# Altium project Extra_Board_Mini.PrjPcb
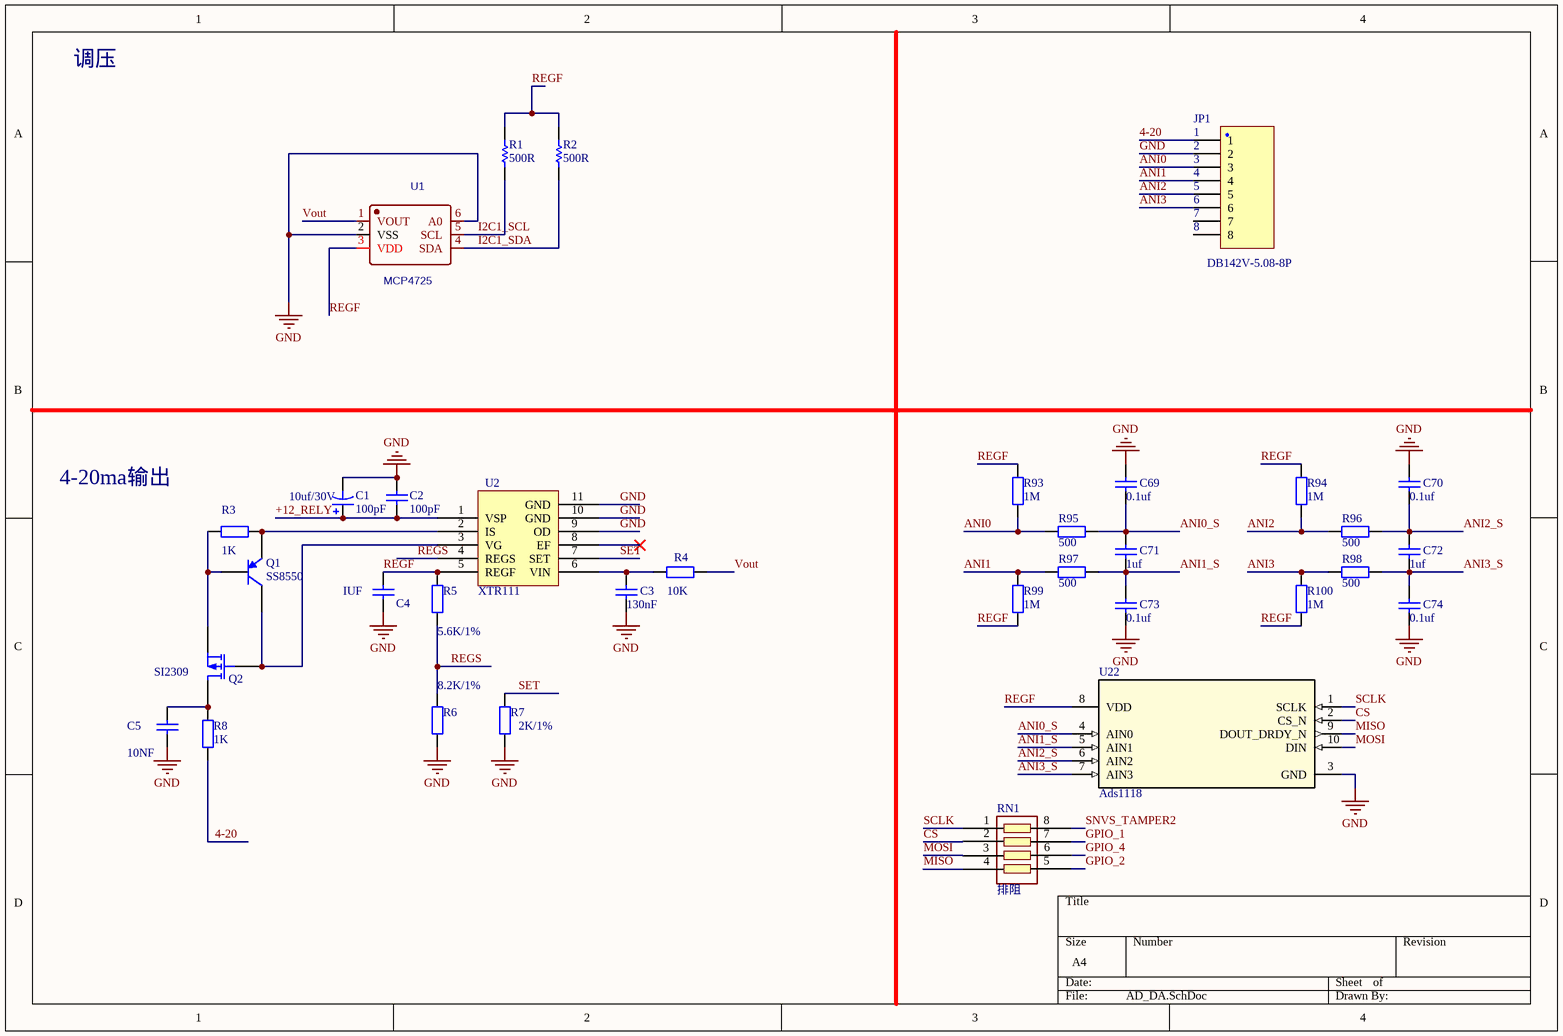
[diagram p0: AD_DA.SchDoc]
6 sheets, 249 parts. Net scope: global (net labels, ports and power ports of the same name join across sheets).
Board file: LinuxMini_ExtraBoard.PcbDoc
Sheets:
  AD_DA.SchDoc
  AD7799.SchDoc
  Connect.SchDoc
  Power.SchDoc
  DIn.SchDoc
  DOut.SchDoc

## Sheet AD_DA.SchDoc
size A4; SheetNumber: 1; SheetTotal: 6

### Parts
C1  10uf/30V  value 100pF  [CC5.05.4]
C2  value 100pF  [0603c]  (hidden comment: 104)
C3  130nF  [0603]
C4  IUF  [0603c]
C5  10NF  [0603c]
C69  0.1uf  [0603c]
C70  0.1uf  [0603c]
C71  1uf  [0603c]
C72  1uf  [0603c]
C73  0.1uf  [0603c]
C74  0.1uf  [0603c]
JP1  DB142V-5.08-8P  [DB142V-5.08-8P]
Q1  SS8550  [SOT-23]
Q2  SI2309  [SOT-23]
R1  500R  [0603r]
R2  500R  [0603r]
R3  value 1K  [0603_R]  (hidden comment: 15R)
R4  10K  [0603_R]
R5  5.6K/1%  [0603_R]
R6  8.2K/1%  [0603_R]
R7  2K/1%  [0603_R]
R8  value 1K  [0603_R]  (hidden comment: 15R)
R93  1M  [0603r]
R94  1M  [0603r]
R95  500  [0603r]
R96  500  [0603r]
R97  500  [0603r]
R98  500  [0603r]
R99  1M  [0603r]
R100  1M  [0603r]
RN1  排阻  [RES_Network]
U1  MCP4725  [MCP4725]
U2  XTR111  [XTR111]
U22  Ads1118  [ads1118]

### Nets
+12_RELY: C1.1 C2.2 U2.1(VSP)
GND: C1.2 C2.1 C3.2 C4.1 C5.2 C69.1 C70.1 C73.2 C74.2 JP1.2 R6.2 R7.1 U1.2(VSS) U1.6(A0) U2.9(OD) U2.10(GND) U2.11(GND) U22.3(GND)
4-20: JP1.1 R8.2
ANI0: JP1.3 R93.1 R95.2
ANI0_S: C69.2 C71.1 R95.1 U22.4(AIN0)
ANI1: JP1.4 R97.1 R99.1
ANI1_S: C71.2 C73.1 R97.2 U22.5(AIN1)
ANI2: JP1.5 R94.1 R96.2
ANI2_S: C70.2 C72.1 R96.1 U22.6(AIN2)
ANI3: JP1.6 R98.1 R100.1
ANI3_S: C72.2 C74.1 R98.2 U22.7(AIN3)
CS: RN1.2 U22.2(CS_N)
GPIO_1: RN1.7
GPIO_2: RN1.5
GPIO_4: RN1.6
I2C1_SCL: R1.1 U1.5(SCL)
I2C1_SDA: R2.1 U1.4(SDA)
MISO: RN1.4 U22.9(DOUT_DRDY_N)
MOSI: RN1.3 U22.10(DIN)
REGF: C4.2 R1.2 R2.2 R5.1 R93.2 R94.2 R99.2 R100.2 U1.3(VDD) U2.5(REGF) U22.8(VDD)
REGS: R5.2 R6.1 U2.4(REGS)
SCLK: RN1.1 U22.1(SCLK)
SET: R7.2 U2.7(SET)
SNVS_TAMPER2: RN1.8
Vout: R4.2 U1.1(VOUT)
NetC3_1: C3.1 R4.1 U2.6(VIN)
NetC5_1: C5.1 Q2.1(D) R8.1
NetQ1_1: Q1.1(C) Q2.2(G) U2.3(VG)
NetQ1_2: Q1.2(B) Q2.3(S) R3.2
NetQ1_3: Q1.3(E) R3.1 U2.2(IS)

Not connected (* = marked no-connect by the designer): JP1 7 8; U2 8(EF)*

### Notes on the sheet
- 调压
- 4-20ma输出

### Library data of the parts
C1 = Cap Pol1: Polarized Capacitor (Radial); Published: 8-Jun-2000; LatestRevisionDate: 17-Jul-2002; LatestRevisionNote: Re-released for DXP Platform.; PackageReference: RB7.6-15; Publisher: Altium Limited; PackageDescription: Polarized Capacitor (Radial); 2 Leads
C2 = Cap: Capacitor; Published: 8-Jun-2000; LatestRevisionDate: 17-Jul-2002; LatestRevisionNote: Re-released for DXP Platform.; PackageReference: RAD-0.3; Publisher: Altium Limited; PackageDescription: Radial Cap, Thru-Hole; 2 Leads; 0.3 in Pin Spacing
C3 C69-C74 = Cap Smd: Capacitor
C4 C5 = Cap: Capacitor; Value: 100pF; Published: 8-Jun-2000; LatestRevisionDate: 17-Jul-2002; LatestRevisionNote: Re-released for DXP Platform.; PackageReference: RAD-0.3; Publisher: Altium Limited; PackageDescription: Radial Cap, Thru-Hole; 2 Leads; 0.3 in Pin Spacing
Q1 = PNP: PNP Bipolar Transistor; Published: 8-Jun-2000; LatestRevisionDate: 29-May-2009; LatestRevisionNote: IPC-7351 Footprint Added.; PackageVersion: Aug-1999; PackageReference: SOT-23B; Publisher: Altium Limited; PackageDescription: 3-Pin SOT-23 Package 0.95 mm Pitch, 2.4 mm Lead Span
Q2 = MOSFET-P: P-Channel MOSFET; Published: 8-Jun-2000; LatestRevisionDate: 17-Jul-2002; LatestRevisionNote: Re-released for DXP Platform.; PackageVersion: 1995/1996; PackageReference: E3; Publisher: Altium Limited; PackageDescription: TO, Flat Index; 3 In-Line, Axial Leads; Body Dia. 4.6mm; Lead Dia. 0.5 mm (max)
R1 R2 = RES: Resistor; Value: 1K; Published: 8-Jun-2000; Revision: July-2002: Re-released for DXP Platform.; Publisher: Altium Limited
R3 R8 R93-R100 = Res2: Resistor; Published: 8-Jun-2000; LatestRevisionDate: 17-Jul-2002; LatestRevisionNote: Re-released for DXP Platform.; PackageReference: AXIAL-0.4; Publisher: Altium Limited; PackageDescription: Axial Device, Thru-Hole; 2 Leads; 0.4 in Pin Spacing
  R93 R94 R99 R100: Value: 1M
  R95-R98: Value: 500
R4-R7 = Res2: Resistor; Value: 1K; Published: 8-Jun-2000; LatestRevisionDate: 17-Jul-2002; LatestRevisionNote: Re-released for DXP Platform.; PackageReference: AXIAL-0.4; Publisher: Altium Limited; PackageDescription: Axial Device, Thru-Hole; 2 Leads; 0.4 in Pin Spacing
RN1 = Res_Network
U1 = MCP4725A0T-E/CH: BOM_Manufacturer: MICROCHIP; Contributor: LCSC; BOM_Supplier: LCSC; BOM_Manufacturer Part: MCP4725A0T-E/CH; BOM_Supplier Part: C144198; BOM_JLCPCB Part Class: Extended Part; spicePre: U; spiceSymbolName: MCP4725A0T-E/CH

## Sheet AD7799.SchDoc
size A4; SheetNumber: 2; SheetTotal: 6
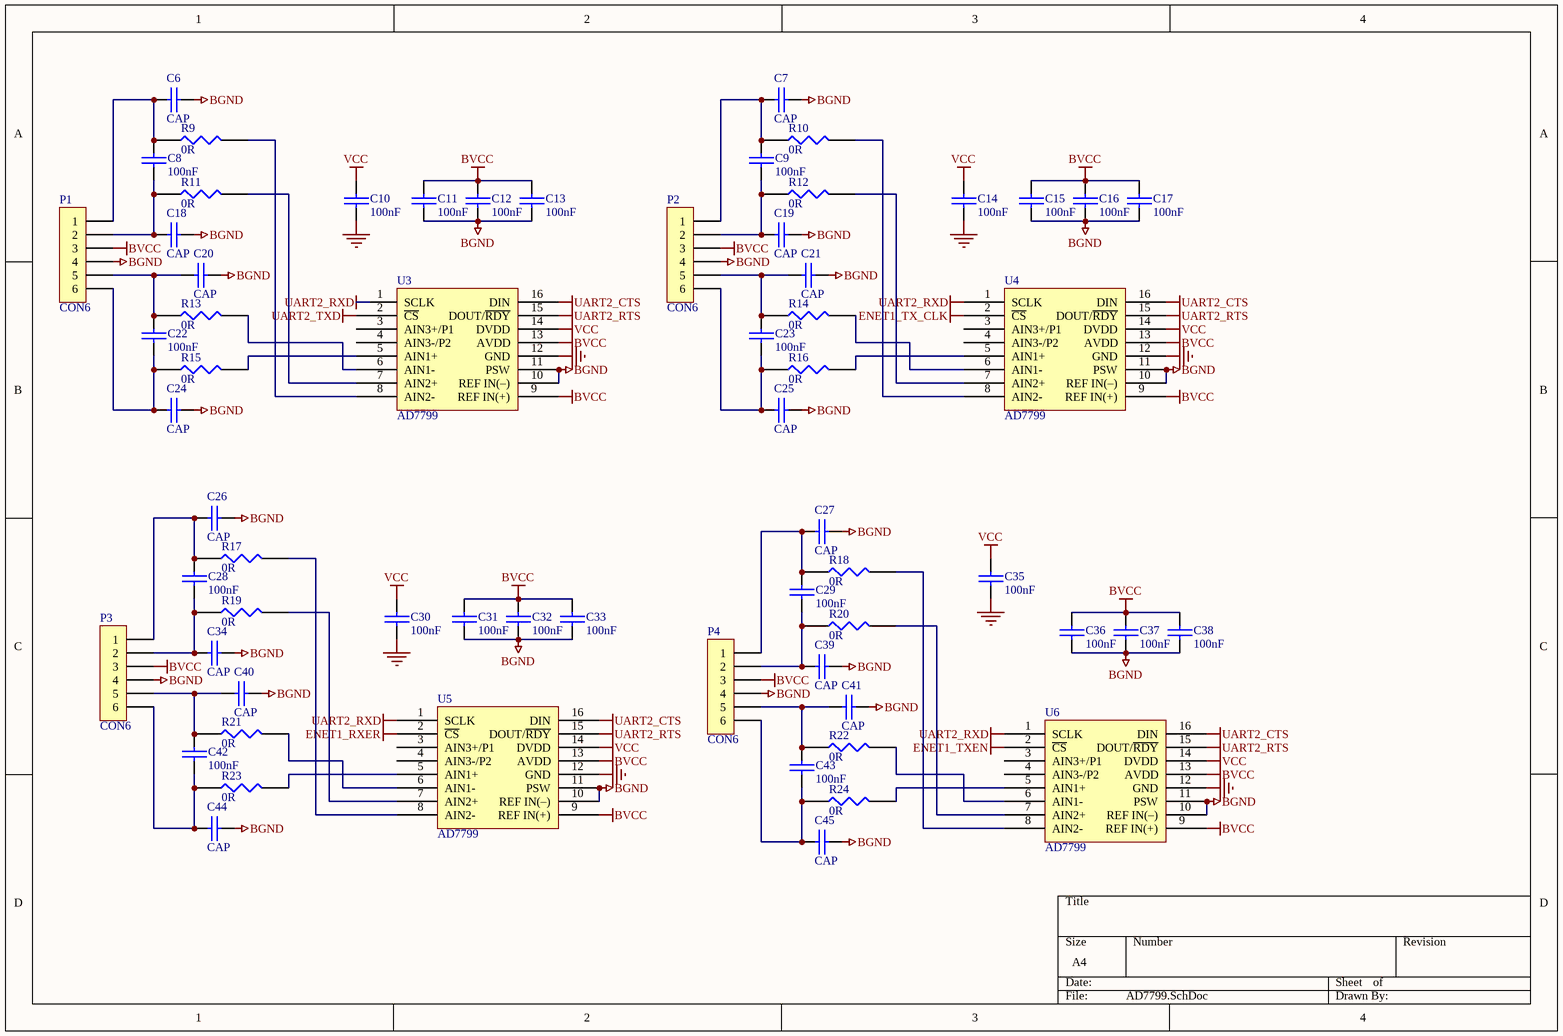
[diagram p1: AD7799.SchDoc]

### Parts
C6  CAP  [0603_C]
C7  CAP  [0603_C]
C8  100nF  [0603_C]
C9  100nF  [0603_C]
C10  100nF  [0603_C]
C11  100nF  [0603_C]
C12  100nF  [0603_C]
C13  100nF  [0603_C]
C14  100nF  [0603_C]
C15  100nF  [0603_C]
C16  100nF  [0603_C]
C17  100nF  [0603_C]
C18  CAP  [0603_C]
C19  CAP  [0603_C]
C20  CAP  [0603_C]
C21  CAP  [0603_C]
C22  100nF  [0603_C]
C23  100nF  [0603_C]
C24  CAP  [0603_C]
C25  CAP  [0603_C]
C26  CAP  [0603_C]
C27  CAP  [0603_C]
C28  100nF  [0603_C]
C29  100nF  [0603_C]
C30  100nF  [0603_C]
C31  100nF  [0603_C]
C32  100nF  [0603_C]
C33  100nF  [0603_C]
C34  CAP  [0603_C]
C35  100nF  [0603_C]
C36  100nF  [0603_C]
C37  100nF  [0603_C]
C38  100nF  [0603_C]
C39  CAP  [0603_C]
C40  CAP  [0603_C]
C41  CAP  [0603_C]
C42  100nF  [0603_C]
C43  100nF  [0603_C]
C44  CAP  [0603_C]
C45  CAP  [0603_C]
P1  CON6  [DB142V-5.08-6P]
P2  CON6  [DB142V-5.08-6P]
P3  CON6  [DB142V-5.08-6P]
P4  CON6  [DB142V-5.08-6P]
R9  0R  [0603_R]
R10  0R  [0603_R]
R11  0R  [0603_R]
R12  0R  [0603_R]
R13  0R  [0603_R]
R14  0R  [0603_R]
R15  0R  [0603_R]
R16  0R  [0603_R]
R17  0R  [0603_R]
R18  0R  [0603_R]
R19  0R  [0603_R]
R20  0R  [0603_R]
R21  0R  [0603_R]
R22  0R  [0603_R]
R23  0R  [0603_R]
R24  0R  [0603_R]
U3  AD7799  [TSSOP16]
U4  AD7799  [TSSOP16]
U5  AD7799  [TSSOP16]
U6  AD7799  [TSSOP16]

### Nets
BGND: C6.2 C7.2 C11.2 C12.2 C13.2 C15.2 C16.2 C17.2 C18.2 C19.2 C20.2 C21.2 C24.2 C25.2 C26.2 C27.2 C31.2 C32.2 C33.2 C34.2 C36.2 C37.2 C38.2 C39.2 C40.2 C41.2 C44.2 C45.2 P1.4 P2.4 P3.4 P4.4 U3.10(REF_IN(–)) U3.11(PSW) U4.10(REF_IN(–)) U4.11(PSW) U5.10(REF_IN(–)) U5.11(PSW) U6.10(REF_IN(–)) U6.11(PSW)
BVCC: C11.1 C12.1 C13.1 C15.1 C16.1 C17.1 C31.1 C32.1 C33.1 C36.1 C37.1 C38.1 P1.3 P2.3 P3.3 P4.3 U3.9(REF_IN(+)) U3.13(AVDD) U4.9(REF_IN(+)) U4.13(AVDD) U5.9(REF_IN(+)) U5.13(AVDD) U6.9(REF_IN(+)) U6.13(AVDD)
ENET1_RXER: U5.2(~{CS})
ENET1_TX_CLK: U4.2(~{CS})
ENET1_TXEN: U6.2(~{CS})
GND: C10.2 C14.2 C30.2 C35.2 U3.12(GND) U4.12(GND) U5.12(GND) U6.12(GND)
UART2_CTS: U3.16(DIN) U4.16(DIN) U5.16(DIN) U6.16(DIN)
UART2_RTS: U3.15(DOUT/~{RDY}) U4.15(DOUT/~{RDY}) U5.15(DOUT/~{RDY}) U6.15(DOUT/~{RDY})
UART2_RXD: U3.1(SCLK) U4.1(SCLK) U5.1(SCLK) U6.1(SCLK)
UART2_TXD: U3.2(~{CS})
VCC: C10.1 C14.1 C30.1 C35.1 U3.14(DVDD) U4.14(DVDD) U5.14(DVDD) U6.14(DVDD)
NetC6_1: C6.1 C8.1 P1.1 R9.1
NetC7_1: C7.1 C9.1 P2.1 R10.1
NetC8_2: C8.2 C18.1 P1.2 R11.1
NetC9_2: C9.2 C19.1 P2.2 R12.1
NetC20_1: C20.1 C22.1 P1.5 R13.1
NetC21_1: C21.1 C23.1 P2.5 R14.1
NetC22_2: C22.2 C24.1 P1.6 R15.1
NetC23_2: C23.2 C25.1 P2.6 R16.1
NetC26_1: C26.1 C28.1 P3.1 R17.1
NetC27_1: C27.1 C29.1 P4.1 R18.1
NetC28_2: C28.2 C34.1 P3.2 R19.1
NetC29_2: C29.2 C39.1 P4.2 R20.1
NetC40_1: C40.1 C42.1 P3.5 R21.1
NetC41_1: C41.1 C43.1 P4.5 R22.1
NetC42_2: C42.2 C44.1 P3.6 R23.1
NetC43_2: C43.2 C45.1 P4.6 R24.1
NetR9_2: R9.2 U3.8(AIN2-)
NetR10_2: R10.2 U4.8(AIN2-)
NetR11_2: R11.2 U3.7(AIN2+)
NetR12_2: R12.2 U4.7(AIN2+)
NetR13_2: R13.2 U3.6(AIN1-)
NetR14_2: R14.2 U4.6(AIN1-)
NetR15_2: R15.2 U3.5(AIN1+)
NetR16_2: R16.2 U4.5(AIN1+)
NetR17_2: R17.2 U5.8(AIN2-)
NetR18_2: R18.2 U6.8(AIN2-)
NetR19_2: R19.2 U5.7(AIN2+)
NetR20_2: R20.2 U6.7(AIN2+)
NetR21_2: R21.2 U5.6(AIN1-)
NetR22_2: R22.2 U6.6(AIN1-)
NetR23_2: R23.2 U5.5(AIN1+)
NetR24_2: R24.2 U6.5(AIN1+)

Not connected (* = marked no-connect by the designer): U3 3(AIN3+/P1) 4(AIN3-/P2); U4 3(AIN3+/P1) 4(AIN3-/P2); U5 3(AIN3+/P1) 4(AIN3-/P2); U6 3(AIN3+/P1) 4(AIN3-/P2)

### Library data of the parts
C6-C45 = CAP: Capacitor
P1-P4 = CON6: Connector
R9-R24 = RES1

## Sheet Connect.SchDoc
size A4; SheetNumber: 3; SheetTotal: 6
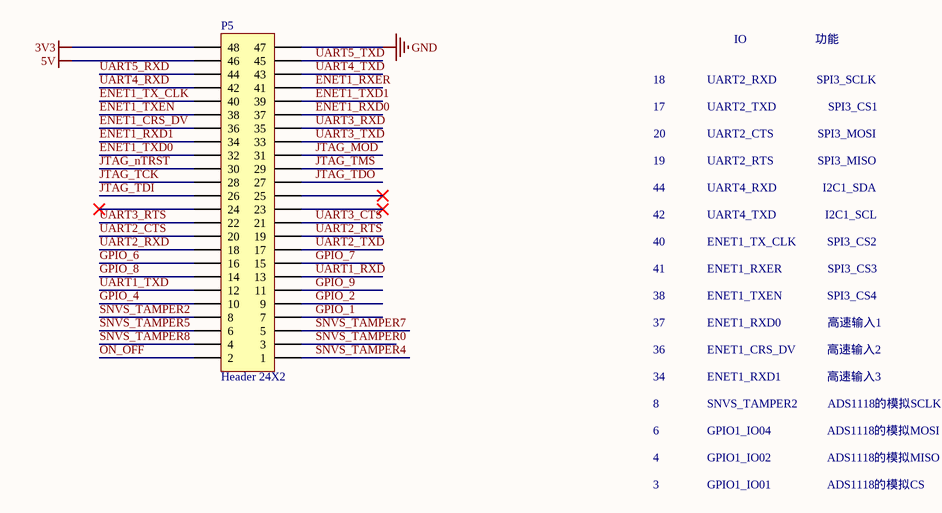
[diagram p2: Connect.SchDoc]

### Parts
P5  Header 24X2  [HDR2X24_2]

### Nets
3V3: P5.48
5V: P5.46
ENET1_RXER: P5.41
ENET1_TX_CLK: P5.40
ENET1_TXEN: P5.38
GND: P5.47
UART2_CTS: P5.20
UART2_RTS: P5.19
UART2_RXD: P5.18
UART2_TXD: P5.17
ENET1_CRS_DV: P5.36
ENET1_RXD0: P5.37
ENET1_RXD1: P5.34
ENET1_TXD0: P5.32
ENET1_TXD1: P5.39
GPIO_1: P5.7
GPIO_2: P5.9
GPIO_4: P5.10
GPIO_6: P5.16
GPIO_7: P5.15
GPIO_8: P5.14
GPIO_9: P5.11
JTAG_MOD: P5.31
JTAG_nTRST: P5.30
JTAG_TCK: P5.28
JTAG_TDI: P5.26
JTAG_TDO: P5.27
JTAG_TMS: P5.29
ON_OFF: P5.2
SNVS_TAMPER0: P5.3
SNVS_TAMPER2: P5.8
SNVS_TAMPER4: P5.1
SNVS_TAMPER5: P5.6
SNVS_TAMPER7: P5.5
SNVS_TAMPER8: P5.4
UART1_RXD: P5.13
UART1_TXD: P5.12
UART3_CTS: P5.21
UART3_RTS: P5.22
UART3_RXD: P5.35
UART3_TXD: P5.33
UART4_RXD: P5.42
UART4_TXD: P5.43
UART5_RXD: P5.44
UART5_TXD: P5.45

Not connected (* = marked no-connect by the designer): P5 23* 24* 25*

### Notes on the sheet
- 18
- UART2_RXD
- IO
- 功能
- SPI3_SCLK
- 17
- 20
- UART2_TXD
- UART2_CTS
- SPI3_MOSI
- SPI3_CS1
- 44
- 19
- 42
- UART2_RTS
- UART4_RXD
- UART4_TXD
- SPI3_MISO
- I2C1_SDA
- I2C1_SCL
- 40
- 41
- ENET1_TX_CLK
- ENET1_RXER
- SPI3_CS2
- SPI3_CS3
- 38
- 37
- 36
- ENET1_TXEN
- ENET1_RXD0
- ENET1_CRS_DV
- SPI3_CS4
- 高速输入2
- 高速输入1
- 34
- 8
- ENET1_RXD1
- SNVS_TAMPER2
- 高速输入3
- ADS1118的模拟SCLK
- 6
- 4
- 3
- GPIO1_IO04
- GPIO1_IO02
- GPIO1_IO01
- ADS1118的模拟MOSI
- ADS1118的模拟MISO
- ADS1118的模拟CS

### Library data of the parts
P5 = Header 24X2: Header, 24-Pin, Dual row; LatestRevisionDate: 17-Jul-2002; LatestRevisionNote: Re-released for DXP Platform.; Publisher: Altium Limited

## Sheet Power.SchDoc
size A4; SheetNumber: 4; SheetTotal: 6
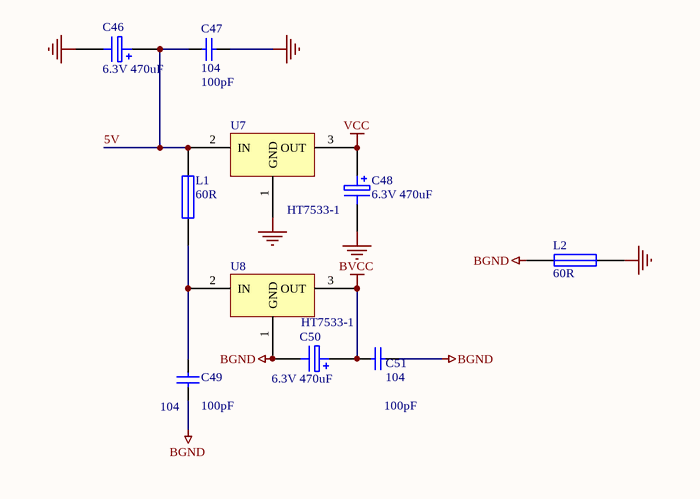
[diagram p3: Power.SchDoc]

### Parts
C46  6.3V 470uF  [CC5.05.4]
C47  104  value 100pF  [0603C]
C48  6.3V 470uF  [CC5.05.4]
C49  104  value 100pF  [0603C]
C50  6.3V 470uF  [CC5.05.4]
C51  104  value 100pF  [0603C]
L1  60R  [0603]
L2  60R  [0603]
U7  HT7533-1  [SOT89_M]
U8  HT7533-1  [SOT89_M]

### Nets
5V: C46.1 C47.2 L1.1 U7.2(IN)
BGND: C49.2 C50.2 C51.1 L2.1 U8.1(GND)
BVCC: C50.1 C51.2 U8.3(OUT)
GND: C46.2 C47.1 C48.2 L2.2 U7.1(GND)
VCC: C48.1 U7.3(OUT)
NetC49_1: C49.1 L1.2 U8.2(IN)

### Library data of the parts
C46 C48 C50 = ELECTRO1: Electrolytic Capacitor
C47 C49 C51 = CAP: Capacitor; Published: 8-Jun-2000; LatestRevisionDate: 17-Jul-2002; LatestRevisionNote: Re-released for DXP Platform.; PackageReference: RAD-0.3; Publisher: Altium Limited; PackageDescription: Radial Cap, Thru-Hole; 2 Leads; 0.3 in Pin Spacing
L1 L2 = FUSE1: Fuse

## Sheet DIn.SchDoc
size A4; SheetNumber: 5; SheetTotal: 6
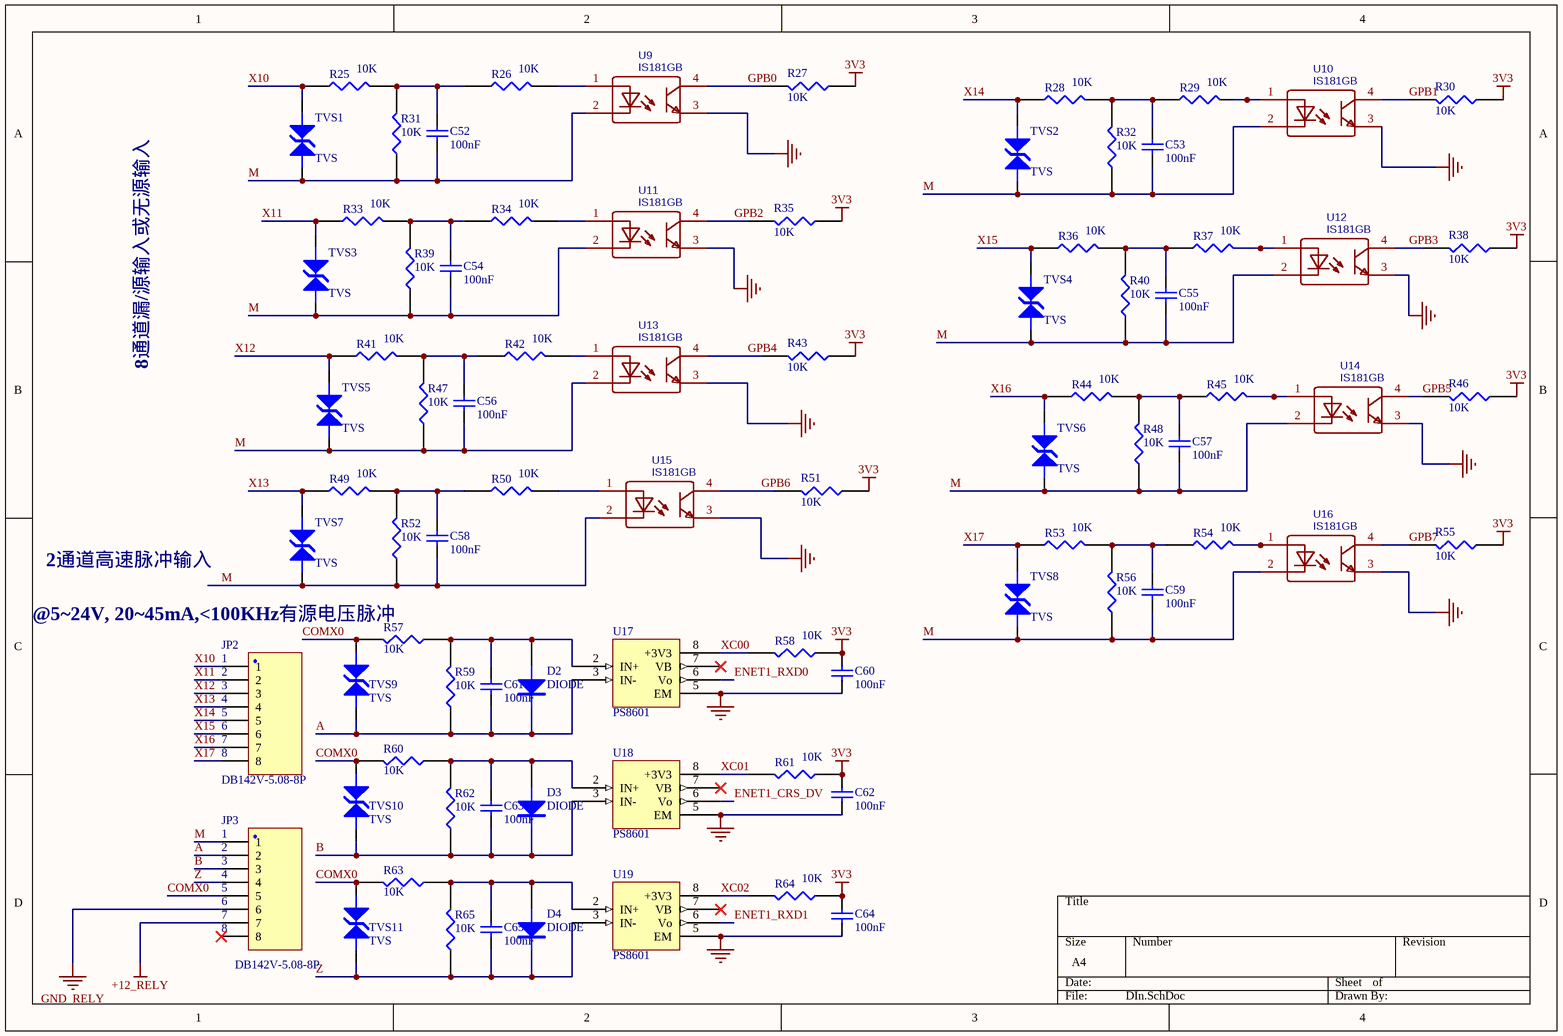
[diagram p4: DIn.SchDoc]

### Parts
C52  100nF  [0603C]
C53  100nF  [0603C]
C54  100nF  [0603C]
C55  100nF  [0603C]
C56  100nF  [0603C]
C57  100nF  [0603C]
C58  100nF  [0603C]
C59  100nF  [0603C]
C60  100nF  [0603C]
C61  100nF  [0603C]
C62  100nF  [0603C]
C63  100nF  [0603C]
C64  100nF  [0603C]
C65  100nF  [0603C]
D2  DIODE  [贴片二极管]
D3  DIODE  [贴片二极管]
D4  DIODE  [贴片二极管]
JP2  DB142V-5.08-8P  [DB142V-5.08-8P]
JP3  DB142V-5.08-8P  [DB142V-5.08-8P]
R25  10K  [0603]
R26  10K  [0603]
R27  10K  [0603]
R28  10K  [0603]
R29  10K  [0603]
R30  10K  [0603]
R31  10K  [0603]
R32  10K  [0603]
R33  10K  [0603]
R34  10K  [0603]
R35  10K  [0603]
R36  10K  [0603]
R37  10K  [0603]
R38  10K  [0603]
R39  10K  [0603]
R40  10K  [0603]
R41  10K  [0603]
R42  10K  [0603]
R43  10K  [0603]
R44  10K  [0603]
R45  10K  [0603]
R46  10K  [0603]
R47  10K  [0603]
R48  10K  [0603]
R49  10K  [0603]
R50  10K  [0603]
R51  10K  [0603]
R52  10K  [0603]
R53  10K  [0603]
R54  10K  [0603]
R55  10K  [0603]
R56  10K  [0603]
R57  10K  [0603]
R58  10K  [0603]
R59  10K  [0603]
R60  10K  [0603]
R61  10K  [0603]
R62  10K  [0603]
R63  10K  [0603]
R64  10K  [0603]
R65  10K  [0603]
TVS1  TVS  [TVS]
TVS2  TVS  [TVS]
TVS3  TVS  [TVS]
TVS4  TVS  [TVS]
TVS5  TVS  [TVS]
TVS6  TVS  [TVS]
TVS7  TVS  [TVS]
TVS8  TVS  [TVS]
TVS9  TVS  [TVS]
TVS10  TVS  [TVS]
TVS11  TVS  [TVS]
U9  IS181GB  [TLP181]
U10  IS181GB  [TLP181]
U11  IS181GB  [TLP181]
U12  IS181GB  [TLP181]
U13  IS181GB  [TLP181]
U14  IS181GB  [TLP181]
U15  IS181GB  [TLP181]
U16  IS181GB  [TLP181]
U17  PS8601  [SMD-8_6.3mm]
U18  PS8601  [SMD-8_6.3mm]
U19  PS8601  [SMD-8_6.3mm]

### Nets
3V3: C60.2 C62.2 C64.2 R27.1 R30.1 R35.1 R38.1 R43.1 R46.1 R51.1 R55.1 R58.1 R61.1 R64.1
+12_RELY: JP3.7
GND: C60.1 C62.1 C64.1 U9.3 U10.3 U11.3 U12.3 U13.3 U14.3 U15.3 U16.3 U17.5(EM) U18.5(EM) U19.5(EM)
GND_RELY: JP3.6
NC: U17.1(NC) U17.4(NC) U18.1(NC) U18.4(NC) U19.1(NC) U19.4(NC)
A: C61.1 D2.2(K) JP3.2 R59.1 TVS9.1(A) U17.3(IN-)
B: C63.1 D3.2(K) JP3.3 R62.1 TVS10.1(A) U18.3(IN-)
COMX0: JP3.5 R57.2 R60.2 R63.2 TVS9.2(K) TVS10.2(K) TVS11.2(K)
ENET1_CRS_DV: U18.6(Vo)
ENET1_RXD0: U17.6(Vo)
ENET1_RXD1: U19.6(Vo)
GPB0: R27.2 U9.4
GPB1: R30.2 U10.4
GPB2: R35.2 U11.4
GPB3: R38.2 U12.4
GPB4: R43.2 U13.4
GPB5: R46.2 U14.4
GPB6: R51.2 U15.4
GPB7: R55.2 U16.4
M: C52.2 C53.1 C54.1 C55.1 C56.1 C57.1 C58.1 C59.1 JP3.1 R31.1 R32.1 R39.1 R40.1 R47.1 R48.1 R52.1 R56.1 TVS1.1(A) TVS2.1(A) TVS3.1(A) TVS4.1(A) TVS5.1(A) TVS6.1(A) TVS7.1(A) TVS8.1(A) U9.2 U10.2 U11.2 U12.2 U13.2 U14.2 U15.2 U16.2
X10: JP2.1 R25.1 TVS1.2(K)
X11: JP2.2 R33.1 TVS3.2(K)
X12: JP2.3 R41.1 TVS5.2(K)
X13: JP2.4 R49.1 TVS7.2(K)
X14: JP2.5 R28.1 TVS2.2(K)
X15: JP2.6 R36.1 TVS4.2(K)
X16: JP2.7 R44.1 TVS6.2(K)
X17: JP2.8 R53.1 TVS8.2(K)
XC00: R58.2 U17.8(+3V3)
XC01: R61.2 U18.8(+3V3)
XC02: R64.2 U19.8(+3V3)
Z: C65.1 D4.2(K) JP3.4 R65.1 TVS11.1(A) U19.3(IN-)
NetC52_1: C52.1 R25.2 R26.1 R31.2
NetC53_2: C53.2 R28.2 R29.1 R32.2
NetC54_2: C54.2 R33.2 R34.1 R39.2
NetC55_2: C55.2 R36.2 R37.1 R40.2
NetC56_2: C56.2 R41.2 R42.1 R47.2
NetC57_2: C57.2 R44.2 R45.1 R48.2
NetC58_2: C58.2 R49.2 R50.1 R52.2
NetC59_2: C59.2 R53.2 R54.1 R56.2
NetC61_2: C61.2 D2.1(A) R57.1 R59.2 U17.2(IN+)
NetC63_2: C63.2 D3.1(A) R60.1 R62.2 U18.2(IN+)
NetC65_2: C65.2 D4.1(A) R63.1 R65.2 U19.2(IN+)
NetR26_2: R26.2 U9.1
NetR29_2: R29.2 U10.1
NetR34_2: R34.2 U11.1
NetR37_2: R37.2 U12.1
NetR42_2: R42.2 U13.1
NetR45_2: R45.2 U14.1
NetR50_2: R50.2 U15.1
NetR54_2: R54.2 U16.1

Not connected (* = marked no-connect by the designer): JP3 8*; U17 7(VB)*; U18 7(VB)*; U19 7(VB)*

### Notes on the sheet
- 8通道漏/源输入或无源输入
- 2通道高速脉冲输入
- @5~24V, 20~45mA,<100KHz有源电压脉冲

### Library data of the parts
C52-C65 = CAP: Capacitor; Value: 104; Published: 8-Jun-2000; LatestRevisionDate: 17-Jul-2002; LatestRevisionNote: Re-released for DXP Platform.; PackageReference: RAD-0.3; Publisher: Altium Limited
R25-R65 = RES1
U9-U16 = IS181GB: BOM_Manufacturer: ISOCOM; BOM_Supplier: LCSC; BOM_Manufacturer Part: IS181GB; BOM_Supplier Part: C84196; BOM_JLCPCB Part Class: Extended Part; spicePre: U; spiceSymbolName: IS181GB
U17-U19 = PS8601: High speed optocoupler

## Sheet DOut.SchDoc
size A3; SheetNumber: 6; SheetTotal: 6
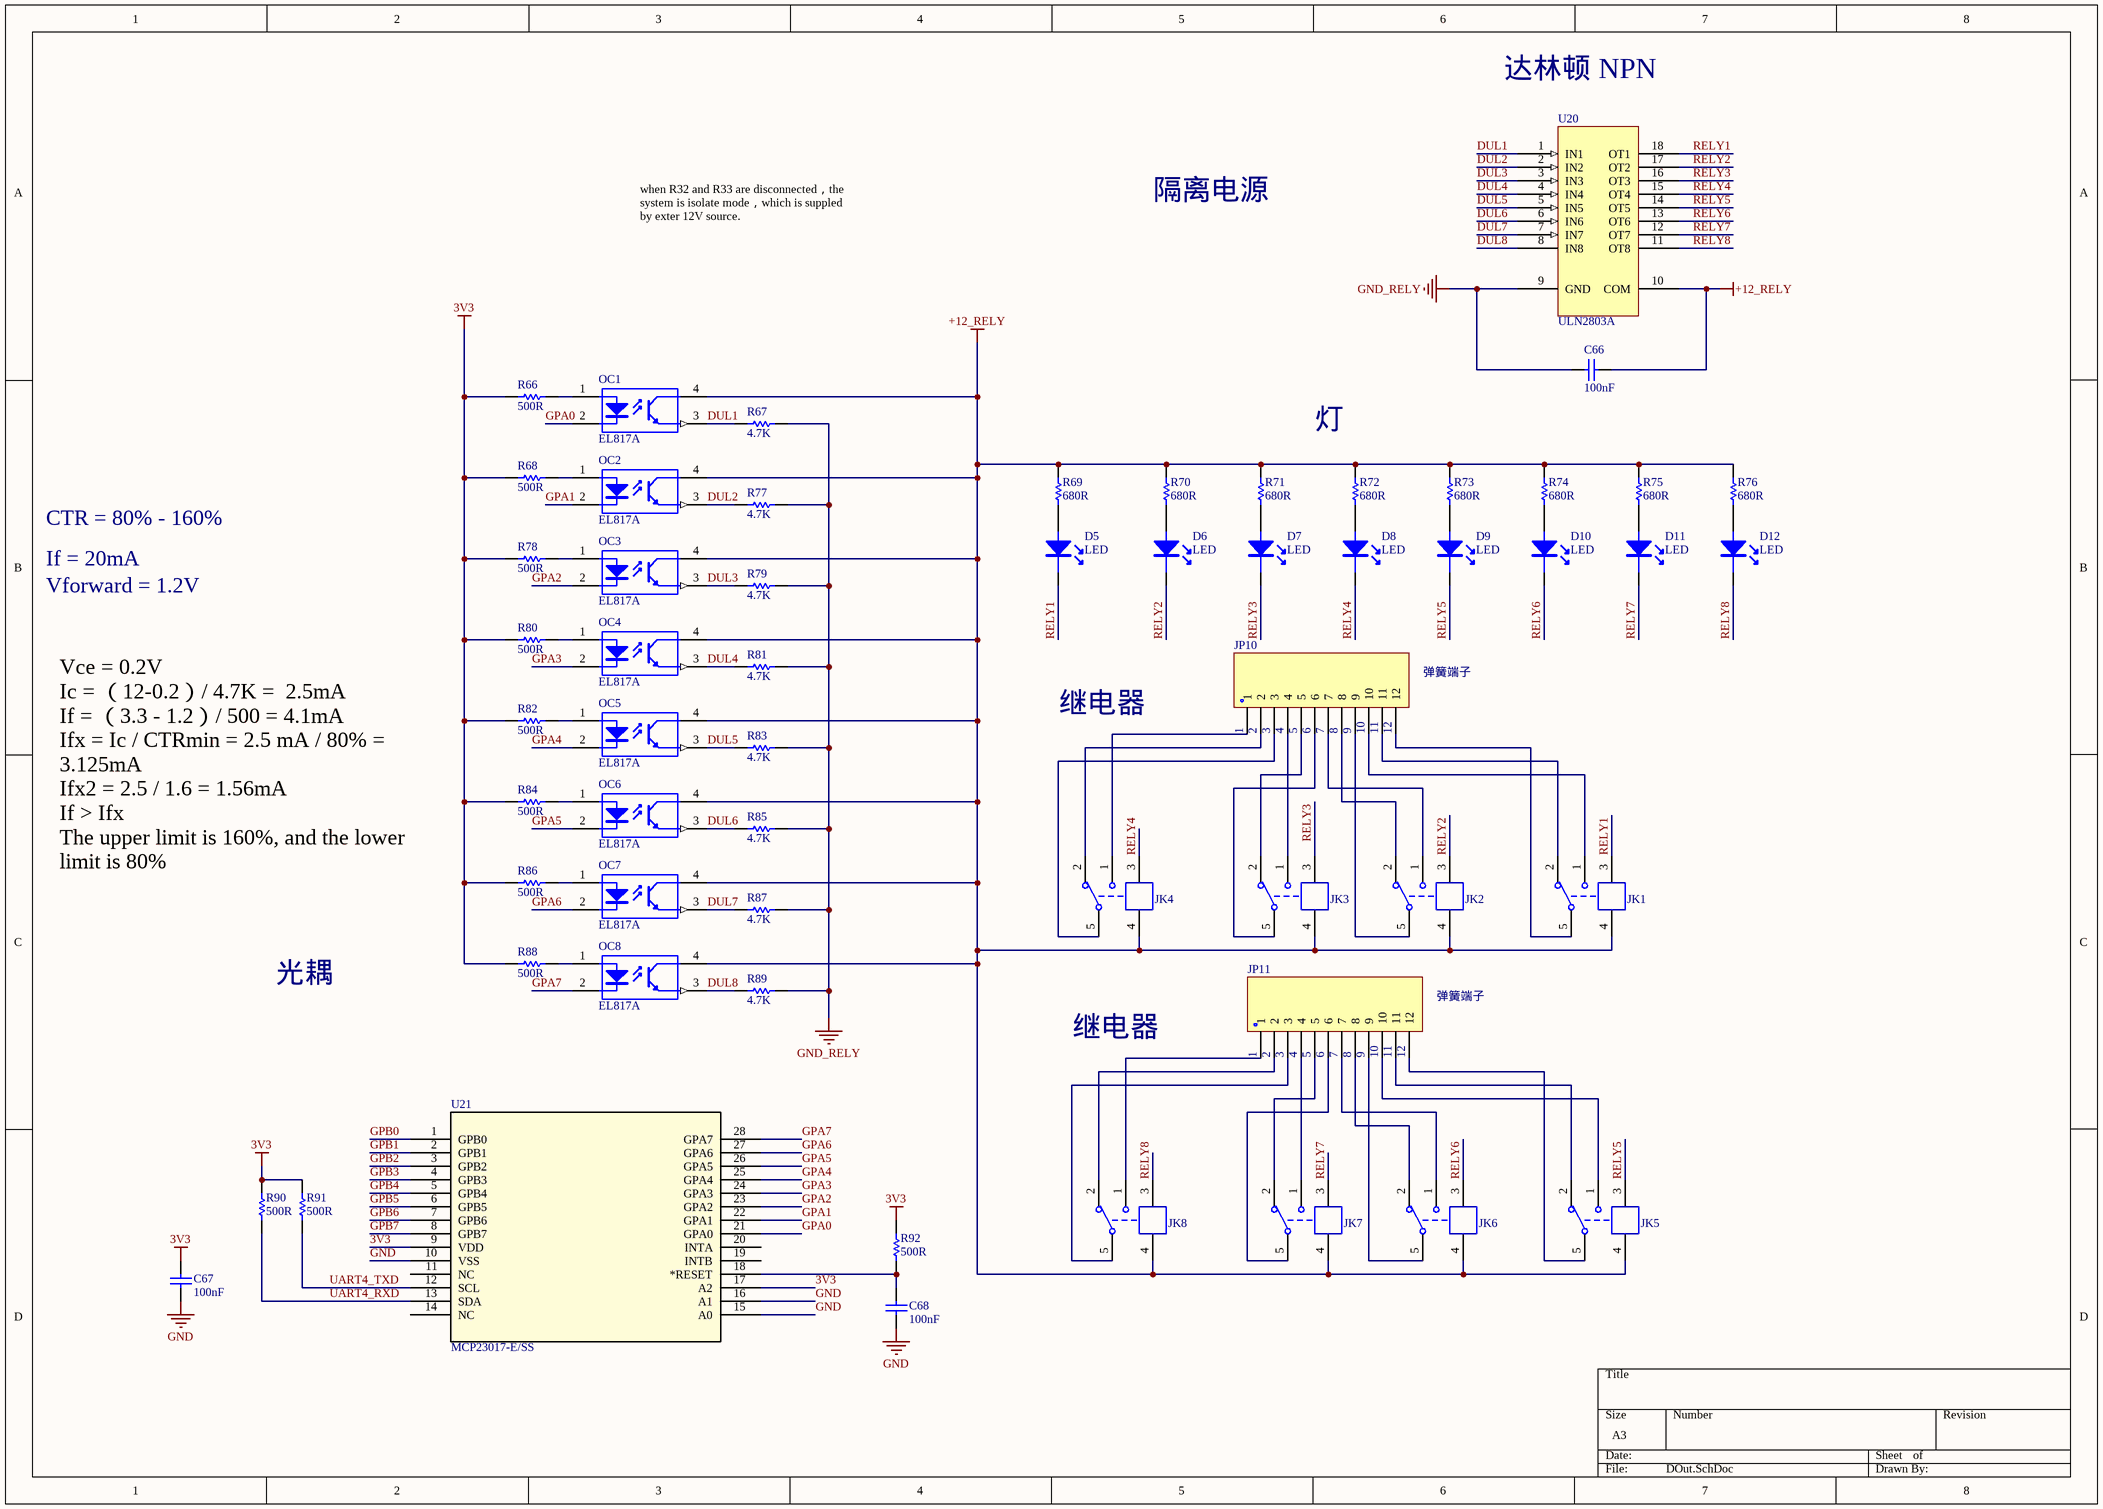
[diagram p5: DOut.SchDoc]

### Parts
C66  100nF  [0603C]
C67  100nF  [0603C]
C68  100nF  [0603C]
D5  LED  [LED-0603G]
D6  LED  [LED-0603G]
D7  LED  [LED-0603G]
D8  LED  [LED-0603G]
D9  LED  [LED-0603G]
D10  LED  [LED-0603G]
D11  LED  [LED-0603G]
D12  LED  [LED-0603G]
JK1  JS-12-K  [JS-12-K]  (value not drawn)
JK2  JS-12-K  [JS-12-K]  (value not drawn)
JK3  JS-12-K  [JS-12-K]  (value not drawn)
JK4  JS-12-K  [JS-12-K]  (value not drawn)
JK5  JS-12-K  [JS-12-K]  (value not drawn)
JK6  JS-12-K  [JS-12-K]  (value not drawn)
JK7  JS-12-K  [JS-12-K]  (value not drawn)
JK8  JS-12-K  [JS-12-K]  (value not drawn)
JP10  弹簧端子  [DB142V-5.08-12P]
JP11  弹簧端子  [DB142V-5.08-12P]
OC1  EL817A  [SMD_PC817]
OC2  EL817A  [SMD_PC817]
OC3  EL817A  [SMD_PC817]
OC4  EL817A  [SMD_PC817]
OC5  EL817A  [SMD_PC817]
OC6  EL817A  [SMD_PC817]
OC7  EL817A  [SMD_PC817]
OC8  EL817A  [SMD_PC817]
R66  500R  [0603r]
R67  4.7K  [0603R]
R68  500R  [0603r]
R69  680R  [0603r]
R70  680R  [0603r]
R71  680R  [0603r]
R72  680R  [0603r]
R73  680R  [0603r]
R74  680R  [0603r]
R75  680R  [0603r]
R76  680R  [0603r]
R77  4.7K  [0603R]
R78  500R  [0603r]
R79  4.7K  [0603R]
R80  500R  [0603r]
R81  4.7K  [0603R]
R82  500R  [0603r]
R83  4.7K  [0603R]
R84  500R  [0603r]
R85  4.7K  [0603R]
R86  500R  [0603r]
R87  4.7K  [0603R]
R88  500R  [0603r]
R89  4.7K  [0603R]
R90  500R  [0603r]
R91  500R  [0603r]
R92  500R  [0603r]
U20  ULN2803A  [SOP18 - 300mil]
U21  MCP23017-E/SS  [SSOP28_MC_MCH]

### Nets
3V3: C67.2 R66.2 R68.2 R78.2 R80.2 R82.2 R84.2 R86.2 R88.2 R90.2 R91.2 R92.2 U21.9(VDD) U21.17(A2)
+12_RELY: C66.2 JK1.4 JK2.4 JK3.4 JK4.4 JK5.4 JK6.4 JK7.4 JK8.4 OC1.4(C) OC2.4(C) OC3.4(C) OC4.4(C) OC5.4(C) OC6.4(C) OC7.4(C) OC8.4(C) R69.1 R70.1 R71.1 R72.1 R73.1 R74.1 R75.1 R76.1 U20.10(COM)
GND: C67.1 C68.1 U21.10(VSS) U21.15(A0) U21.16(A1)
GND_RELY: C66.1 R67.2 R77.2 R79.2 R81.2 R83.2 R85.2 R87.2 R89.2 U20.9(GND)
DUL1: OC1.3(E) R67.1 U20.1(IN1)
DUL2: OC2.3(E) R77.1 U20.2(IN2)
DUL3: OC3.3(E) R79.1 U20.3(IN3)
DUL4: OC4.3(E) R81.1 U20.4(IN4)
DUL5: OC5.3(E) R83.1 U20.5(IN5)
DUL6: OC6.3(E) R85.1 U20.6(IN6)
DUL7: OC7.3(E) R87.1 U20.7(IN7)
DUL8: OC8.3(E) R89.1 U20.8(IN8)
GPA0: OC1.2(K) U21.21(GPA0)
GPA1: OC2.2(K) U21.22(GPA1)
GPA2: OC3.2(K) U21.23(GPA2)
GPA3: OC4.2(K) U21.24(GPA3)
GPA4: OC5.2(K) U21.25(GPA4)
GPA5: OC6.2(K) U21.26(GPA5)
GPA6: OC7.2(K) U21.27(GPA6)
GPA7: OC8.2(K) U21.28(GPA7)
GPB0: U21.1(GPB0)
GPB1: U21.2(GPB1)
GPB2: U21.3(GPB2)
GPB3: U21.4(GPB3)
GPB4: U21.5(GPB4)
GPB5: U21.6(GPB5)
GPB6: U21.7(GPB6)
GPB7: U21.8(GPB7)
RELY1: D5.2(K) JK1.3 U20.18(OT1)
RELY2: D6.2(K) JK2.3 U20.17(OT2)
RELY3: D7.2(K) JK3.3 U20.16(OT3)
RELY4: D8.2(K) JK4.3 U20.15(OT4)
RELY5: D9.2(K) JK5.3 U20.14(OT5)
RELY6: D10.2(K) JK6.3 U20.13(OT6)
RELY7: D11.2(K) JK7.3 U20.12(OT7)
RELY8: D12.2(K) JK8.3 U20.11(OT8)
UART4_RXD: R90.1 U21.13(SDA)
UART4_TXD: R91.1 U21.12(SCL)
NetC68_2: C68.2 R92.1 U21.18(*RESET)
NetD5_1: D5.1(A) R69.2
NetD6_1: D6.1(A) R70.2
NetD7_1: D7.1(A) R71.2
NetD8_1: D8.1(A) R72.2
NetD9_1: D9.1(A) R73.2
NetD10_1: D10.1(A) R74.2
NetD11_1: D11.1(A) R75.2
NetD12_1: D12.1(A) R76.2
NetJK1_1: JK1.1 JP10.10
NetJK1_2: JK1.2 JP10.11
NetJK1_5: JK1.5 JP10.12
NetJK2_1: JK2.1 JP10.7
NetJK2_2: JK2.2 JP10.8
NetJK2_5: JK2.5 JP10.9
NetJK3_1: JK3.1 JP10.4
NetJK3_2: JK3.2 JP10.5
NetJK3_5: JK3.5 JP10.6
NetJK4_1: JK4.1 JP10.1
NetJK4_2: JK4.2 JP10.2
NetJK4_5: JK4.5 JP10.3
NetJK5_1: JK5.1 JP11.10
NetJK5_2: JK5.2 JP11.11
NetJK5_5: JK5.5 JP11.12
NetJK6_1: JK6.1 JP11.7
NetJK6_2: JK6.2 JP11.8
NetJK6_5: JK6.5 JP11.9
NetJK7_1: JK7.1 JP11.4
NetJK7_2: JK7.2 JP11.5
NetJK7_5: JK7.5 JP11.6
NetJK8_1: JK8.1 JP11.1
NetJK8_2: JK8.2 JP11.2
NetJK8_5: JK8.5 JP11.3
NetOC1_1: OC1.1(A) R66.1
NetOC2_1: OC2.1(A) R68.1
NetOC3_1: OC3.1(A) R78.1
NetOC4_1: OC4.1(A) R80.1
NetOC5_1: OC5.1(A) R82.1
NetOC6_1: OC6.1(A) R84.1
NetOC7_1: OC7.1(A) R86.1
NetOC8_1: OC8.1(A) R88.1

Not connected (* = marked no-connect by the designer): U21 11(NC) 14(NC) 19(INTB) 20(INTA)

### Notes on the sheet
- 达林顿 NPN
- when R32 and R33 are disconnected，the system is isolate mode，which is suppled by exter 12V source.
- 隔离电源
- 灯
- CTR = 80% - 160%
- If = 20mA
- Vforward = 1.2V
- 继电器
- Vce = 0.2V
  Ic = （12-0.2）/ 4.7K =  2.5mA
  If = （3.3 - 1.2）/ 500 = 4.1mA
  Ifx = Ic / CTRmin = 2.5 mA / 80% = 3.125mA
  Ifx2 = 2.5 / 1.6 = 1.56mA
  If > Ifx
  The upper limit is 160%, and the lower limit is 80%
- 光耦

### Library data of the parts
C66-C68 = CAP: Capacitor; Value: 104; Published: 8-Jun-2000; LatestRevisionDate: 17-Jul-2002; LatestRevisionNote: Re-released for DXP Platform.; PackageReference: RAD-0.3; Publisher: Altium Limited
D5-D12 = LED: LED 发光二极管
JK1-JK8 = JS-12-K: 12V一组转换
JP10 JP11 = DB142V-5.08-12P
OC1-OC8 = EL357N: 线性光耦
R66-R92 = RES: Resistor; Value: 1K; Published: 8-Jun-2000; Revision: July-2002: Re-released for DXP Platform.; Publisher: Altium Limited
U20 = ULN2803A: 8 channels Darlington
U21 = MCP23017-E/SS: No Description Available; Mfr_Name: Microchip; Copyright: Copyright (C) 2021 Ultra Librarian. All rights reserved.; Manufacturer_Part_Number: MCP23017-E/SS; RefDes: RefDes; Type: DEV

## Nets that join several sheets
3V3: Connect (P5.48), DIn (14 pins), DOut (14 pins)
5V: Connect (P5.46), Power (C46.1 C47.2 L1.1 U7.2)
+12_RELY: AD_DA (C1.1 C2.2 U2.1), DIn (JP3.7), DOut (26 pins)
BGND: AD7799 (40 pins), Power (5 pins)
BVCC: AD7799 (24 pins), Power (C50.1 C51.2 U8.3)
ENET1_RXER: AD7799 (U5.2), Connect (P5.41)
ENET1_TX_CLK: AD7799 (U4.2), Connect (P5.40)
ENET1_TXEN: AD7799 (U6.2), Connect (P5.38)
GND: AD_DA (18 pins), AD7799 (8 pins), Connect (P5.47), Power (5 pins), DIn (14 pins), DOut (5 pins)
GND_RELY: DIn (JP3.6), DOut (10 pins)
UART2_CTS: AD7799 (U3.16 U4.16 U5.16 U6.16), Connect (P5.20)
UART2_RTS: AD7799 (U3.15 U4.15 U5.15 U6.15), Connect (P5.19)
UART2_RXD: AD7799 (U3.1 U4.1 U5.1 U6.1), Connect (P5.18)
UART2_TXD: AD7799 (U3.2), Connect (P5.17)
VCC: AD7799 (8 pins), Power (C48.1 U7.3)
ENET1_CRS_DV: Connect (P5.36), DIn (U18.6)
ENET1_RXD0: Connect (P5.37), DIn (U17.6)
ENET1_RXD1: Connect (P5.34), DIn (U19.6)
GPB0: DIn (R27.2 U9.4), DOut (U21.1)
GPB1: DIn (R30.2 U10.4), DOut (U21.2)
GPB2: DIn (R35.2 U11.4), DOut (U21.3)
GPB3: DIn (R38.2 U12.4), DOut (U21.4)
GPB4: DIn (R43.2 U13.4), DOut (U21.5)
GPB5: DIn (R46.2 U14.4), DOut (U21.6)
GPB6: DIn (R51.2 U15.4), DOut (U21.7)
GPB7: DIn (R55.2 U16.4), DOut (U21.8)
GPIO_1: AD_DA (RN1.7), Connect (P5.7)
GPIO_2: AD_DA (RN1.5), Connect (P5.9)
GPIO_4: AD_DA (RN1.6), Connect (P5.10)
SNVS_TAMPER2: AD_DA (RN1.8), Connect (P5.8)
UART4_RXD: Connect (P5.42), DOut (R90.1 U21.13)
UART4_TXD: Connect (P5.43), DOut (R91.1 U21.12)